# EAGLE design blinkmusb_b1 (EAGLE 5.11)
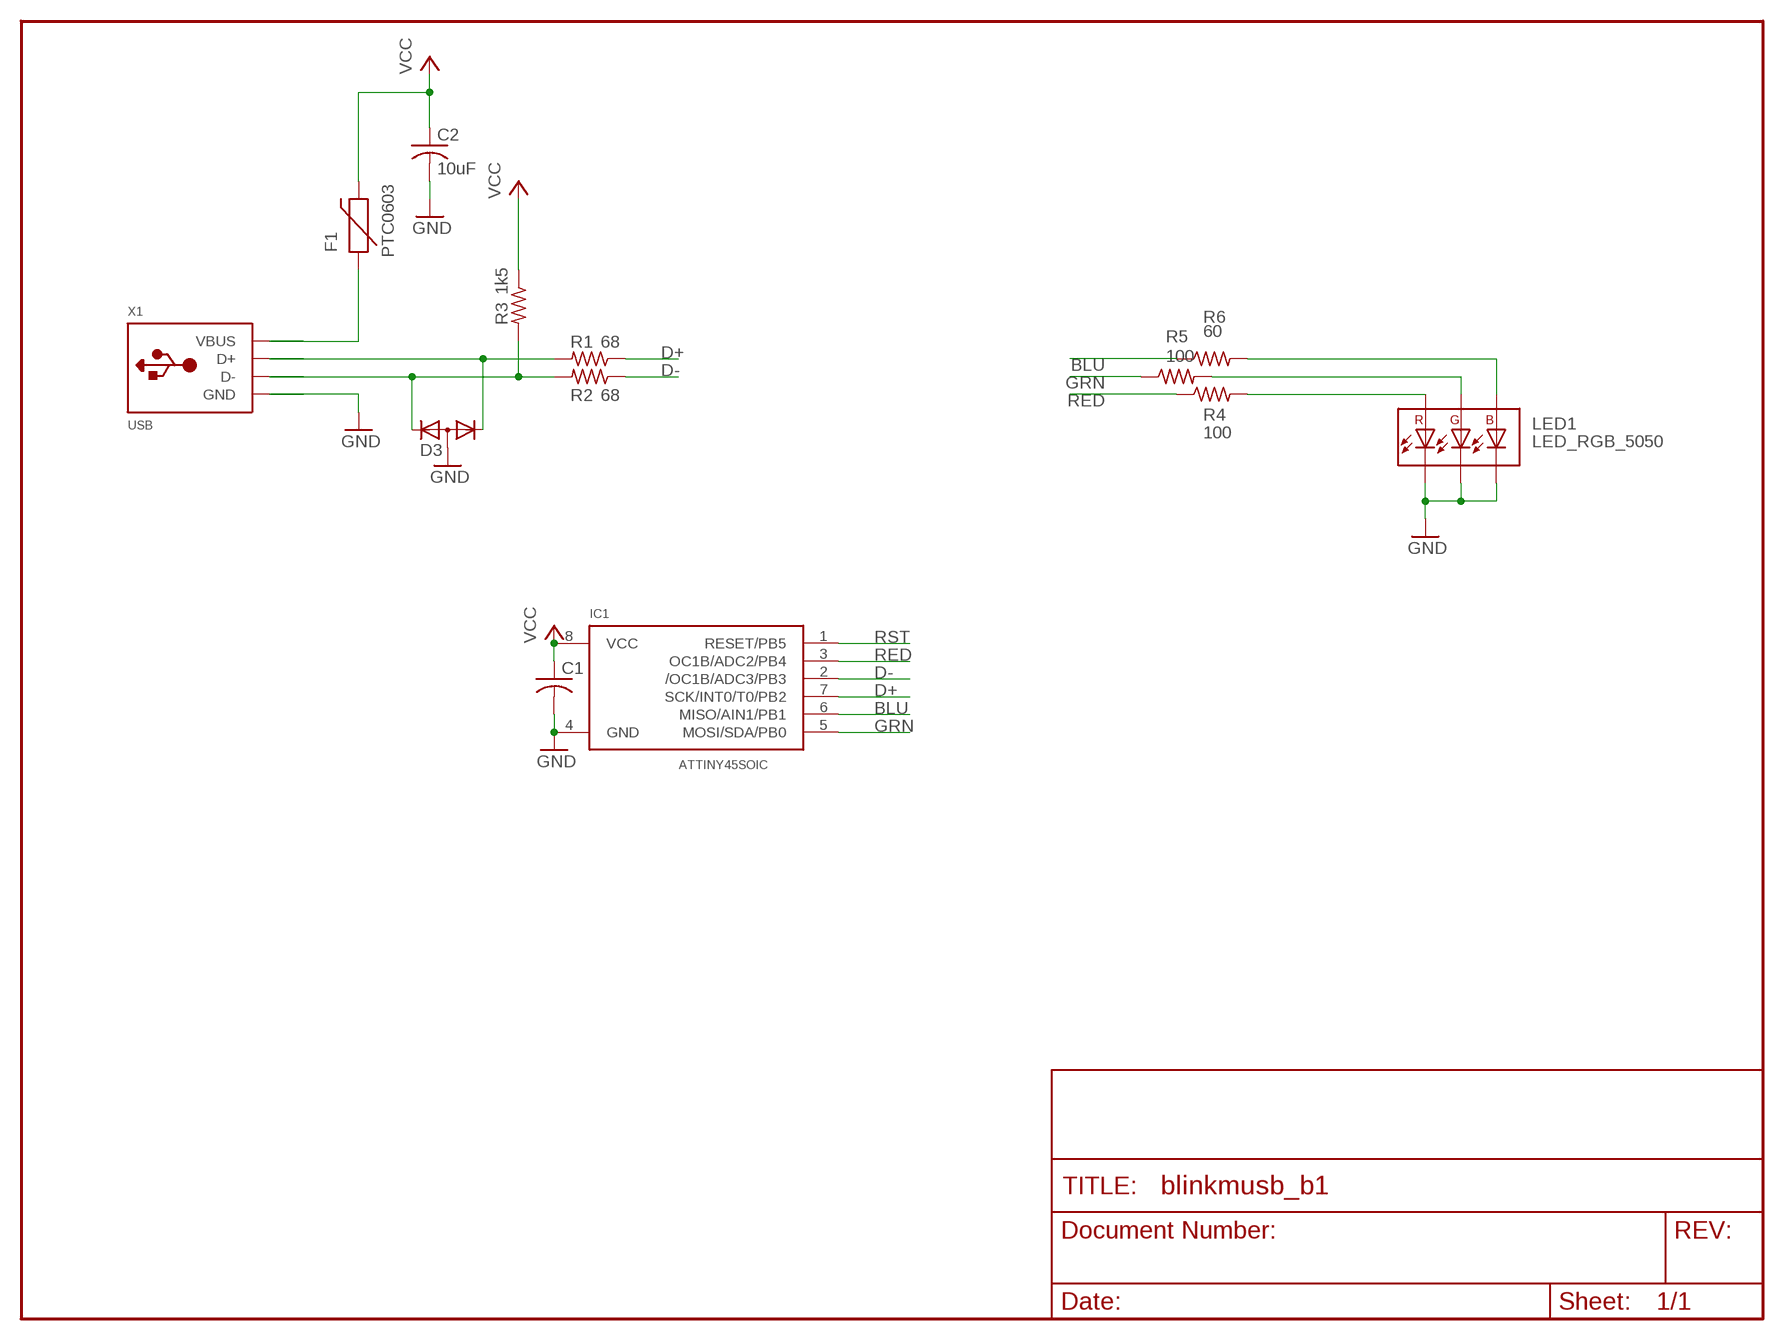
[diagram p0: schematic, sheet 1]

## Parts
C1  C-USC0603  [C0603]
C2  10uF  C-USC0805  [C0805]
D3  DIODE-2CA|ACSOT23  [SOT23]
F1  PTC0603  [0603]
IC1  ATTINY45SOIC  [SO08-EIAJ]
LED1  LED_RGB_5050  [LED_5050]
R1  68  R-US_R0603  [R0603]
R2  68  R-US_R0603  [R0603]
R3  1k5  R-US_R0603  [R0603]
R4  100  R-US_R0603  [R0603]
R5  100  R-US_R0603  [R0603]
R6  60  R-US_R0603  [R0603]
X1  USB  [MOLEX-48037-1000]

## Nets
BLU: IC1.6(MISO/AIN1/PB1) R6.1
D+: IC1.7(SCK/INT0/T0/PB2) R1.1
D-: IC1.2(/OC1B/ADC3/PB3) R2.1
GND: C1.2 C2.2 D3.3(A) IC1.4(GND) LED1.P$4(C2) LED1.P$5(C1) LED1.P$6(C0) X1.4(GND)
GRN: IC1.5(MOSI/SDA/PB0) R5.1
N$4: D3.1(K1) R1.2 X1.3(D+)
N$5: D3.2(K2) R2.2 R3.2 X1.2(D-)
N$13: F1.1 X1.1(VBUS)
RBLU: LED1.P$3(A2) R6.2
RED: IC1.3(OC1B/ADC2/PB4) R4.1
RGRN: LED1.P$2(A1) R5.2
RRED: LED1.P$1(A0) R4.2
RST: IC1.1(RESET/PB5)
VCC: C1.1 C2.1 F1.2 IC1.8(VCC) R3.1

## Library data of the parts
C1 C2 = rcl:C-US: CAPACITOR, American symbol
D3 = diode:DIODE-2CA|AC: Dual DIODE Cathode-Anode|Anode-Cathode
F1 = SparkFun-20110517:PTC: Resettable Fuse PTC Resettable Fuse. Spark Fun Electronics SKU : COM-08357
IC1 = todstuff:ATTINY45
LED1 = todstuff:LED_RGB_5050
R1-R6 = rcl:R-US_: RESISTOR, American symbol
X1 = todstuff:USB

## Board
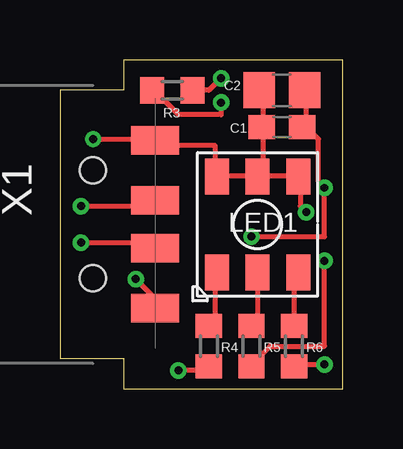
[diagram p1: board, top side]
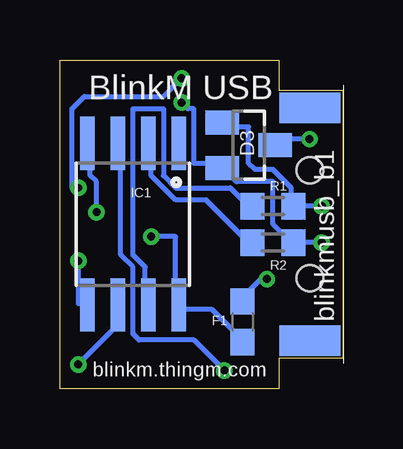
[diagram p2: board, bottom side, seen from below]

Size 11.8 x 13.72 mm. Coordinates in mm from the lower left corner, seen from the top.
Outline: 0,1.27 2.66,1.27 2.66,0 11.8,0 11.8,1.02 11.8,12.7 11.8,13.21 11.8,13.72 2.66,13.72 2.66,12.45 0,12.45 0,1.27
Copper layers (1*16): Top 0.0356mm / dielectric 1.5011mm / Bottom 0.0356mm
Design rules "LaenPCBOrder *": minimum track width 8mil, minimum drill 13mil, track to track 6mil, track to pad 8mil, pad to pad 8mil, via to via 8mil, smd to smd 6mil, copper to edge 15mil, drill to drill 8mil, minimum pad ring 7mil, minimum via ring 7mil, stop-mask expansion 4mil, vias tented up to drill 25mil, thermal gap 10mil

### Footprints (pad centres in the part's own frame; a part is rotated, then mirrored left to right if it is on the bottom)
C0603 = smd 1.1 x 1: 1 -0.85,0; 2 0.85,0
C0805 = smd 1.3 x 1.5: 1 -0.95,0; 2 0.95,0
SOT23 = smd 1 x 1.4: 1 -0.95,-1.1; 2 0.95,-1.1; 3 0,1.1
0603 = smd 1.1 x 1: 1 -0.85,0; 2 0.85,0
SO08-EIAJ = smd 0.61 x 2.21: 1 -1.905,-3.378; 2 -0.635,-3.378; 3 0.635,-3.378; 4 1.905,-3.378; 5 1.905,3.353; 6 0.635,3.353; 7 -0.635,3.353; 8 -1.905,3.353
LED_5050 = smd 1 x 1.5: P$1 1.7,2; P$2 0,2; P$3 -1.7,2; P$4 -1.7,-2; P$5 0,-2; P$6 1.7,-2
R0603 = smd 1 x 1.1: 1 -0.85,0; 2 0.85,0
MOLEX-48037-1000 = smd 2 x 1.2: 1 2.6,-3.5; 2 2.6,-1; 3 2.6,1; 4 2.6,3.5 | smd 2.54 x 1.27 bottom: P$1 0,4.85; P$2 0,-4.85 | hole 1.1: 0,2.25; 0,-2.25

### Placement (x,y rotation side)
C1  9.26,10.92 180 top
C2  9.26,12.45 180 top
D3  3.93,10.16 270 bottom
F1  4.18,2.79 270 bottom
IC1  8.75,6.86 180 bottom
LED1  8.24,6.86 180 top
R1  2.91,7.62 0 bottom
R2  2.91,6.1 0 bottom
R3  4.69,12.45 180 top
R4  6.21,1.78 90 top
R5  7.99,1.78 90 top
R6  9.77,1.78 90 top
X1  1.38,6.86 0 top

### Tracks (layer width: path | path; a pad name or v marks a point on that pad's centre or on a via)
BLU  (via drill 0.33)
  Top 0.203: v11.04,1.02 9.77,1.02 R6.1
  Bottom 0.203: v11.04,1.02 9.51,2.54 9.51,3.3 IC1.6
D+
  Bottom 0.203: R1.1 3.93,7.62 4.69,8.38 6.97,8.38 7.48,8.89 7.48,11.68 8.75,11.68 8.75,5.59 8.24,5.08 8.24,3.56 IC1.7
D-
  Bottom 0.203: R2.1 3.93,6.1 5.7,7.87 6.97,7.87 7.99,8.89 7.99,10.16 IC1.2
GND  (via drill 0.33)
  Top 0.203: v1.39,10.41 3.93,10.41 X1.4 4.18,10.16 6.47,10.16 6.47,8.89 LED1.P$6 6.72,8.89 8.24,8.89 | 8.5,10.92 8.5,12.45 C2.2 | 8.5,10.92 C1.2 8.5,10.92 | 8.24,8.89 LED1.P$5 | 8.24,8.89 8.5,8.89 | 8.5,8.89 9.77,8.89 LED1.P$4 10.02,8.64 10.02,7.62 v10.28,7.37 | 8.24,8.89 LED1.P$5 | 8.5,8.89 8.5,10.92 | LED1.P$5 8.5,8.89
  Bottom 0.203: v1.39,10.41 2.4,10.41 2.66,10.16 D3.3 | v10.28,7.37 10.28,8.64 10.53,8.89 10.53,10.16 IC1.4
GRN  (via drill 0.33)
  Top 0.203: v11.04,5.33 11.04,1.78 8.75,1.78 7.99,1.02 R5.1
  Bottom 0.203: v11.04,5.33 11.04,3.56 10.78,3.56 IC1.5
N$4  (via drill 0.33)
  Top 0.203: v0.88,7.62 3.93,7.62 X1.3
  Bottom 0.203: D3.1 4.94,10.92 3.93,10.92 3.93,9.4 3.67,9.14 2.91,9.14 2.15,8.38 2.15,7.62 R1.2 1.89,7.62 v0.88,7.62
N$5  (via drill 0.33)
  Top 0.203: v6.72,11.94 6.72,11.43 4.94,11.43 3.93,12.45 R3.2 | v0.88,6.1 3.93,6.1 X1.2
  Bottom 0.203: v6.72,11.94 6.47,11.68 6.21,11.68 6.21,9.4 5.2,9.4 D3.2 4.94,9.14 4.43,8.64 2.91,8.64 2.91,6.86 2.15,6.1 R2.2 1.89,6.1 v0.88,6.1
N$13  (via drill 0.33)
  Top 0.203: v3.16,4.57 3.93,3.81 3.93,3.56 X1.1
  Bottom 0.203: v3.16,4.57 3.42,4.57 4.18,3.81 F1.1
RBLU
  Top 0.203: R6.2 9.77,2.79 9.77,4.83 LED1.P$3
RED  (via drill 0.33)
  Top 0.203: v4.94,0.76 6.21,0.76 R4.1
  Bottom 0.203: v4.94,0.76 6.21,2.03 8.5,2.03 8.75,2.29 8.75,5.08 9.26,5.59 9.26,10.16 IC1.3
RGRN
  Top 0.203: R5.2 7.99,2.79 8.24,3.05 8.24,4.83 LED1.P$2
RRED
  Top 0.203: R4.2 6.21,2.79 6.47,3.05 6.47,4.83 LED1.P$1
VCC  (via drill 0.33)
  Top 0.203: 10.28,10.92 10.28,12.45 C2.1 | 10.28,10.92 C1.1 10.28,10.92 | v6.72,12.95 6.21,12.45 5.7,12.45 R3.1 | 10.28,10.92 10.78,10.41 10.78,8.64 v11.04,8.38 11.04,6.35 v7.99,6.35
  Bottom 0.203: F1.2 4.18,2.03 5.45,3.3 6.72,3.3 IC1.8 6.97,3.56 6.97,6.35 v7.99,6.35 | v6.72,12.95 7.48,12.19 10.78,12.19 11.29,11.68 11.29,8.38 v11.04,8.38

### Text on the board
bPlace: BlinkM USB | blinkmusb_b1 | blinkm.thingm.com